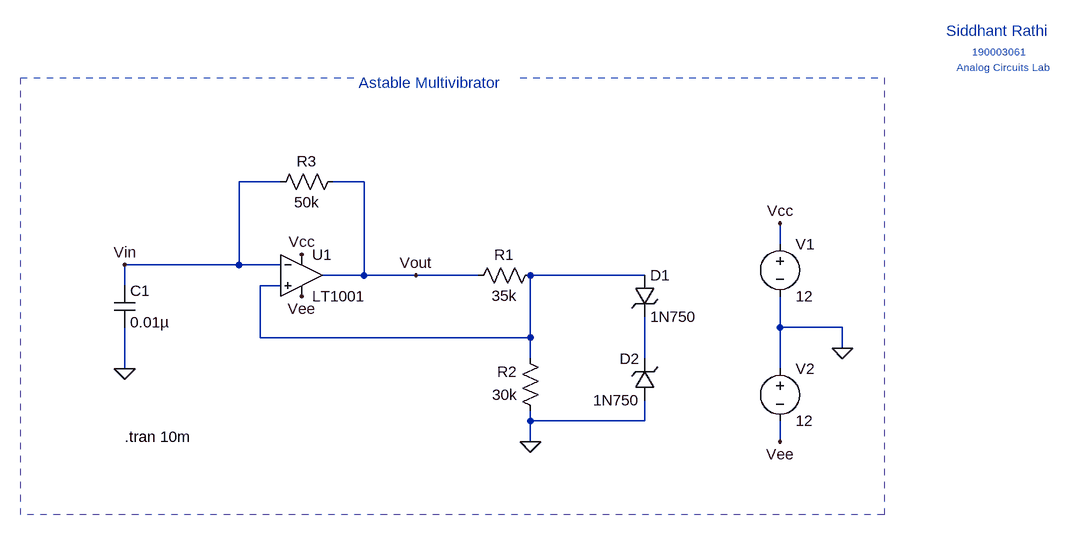
[diagram p0: schematic AstableMultivibrator.asc]
AstableMultivibrator.asc, the LTspice schematic file:
Version 4
SHEET 1 1780 680
WIRE 144 48 80 48
WIRE 272 48 224 48
WIRE 912 144 912 112
WIRE 80 176 80 48
WIRE 80 176 -96 176
WIRE 144 176 80 176
WIRE 272 192 272 48
WIRE 272 192 208 192
WIRE 352 192 272 192
WIRE 448 192 352 192
WIRE 704 192 528 192
WIRE -96 208 -96 176
WIRE 144 208 112 208
WIRE 912 272 912 224
WIRE 1008 272 912 272
WIRE 112 288 112 208
WIRE 528 288 528 192
WIRE 528 288 112 288
WIRE 1008 304 1008 272
WIRE 528 320 528 288
WIRE 704 320 704 256
WIRE -96 336 -96 272
WIRE 912 336 912 272
WIRE 528 416 528 400
WIRE 704 416 704 384
WIRE 704 416 528 416
WIRE 528 448 528 416
WIRE 912 448 912 416
FLAG -96 336 0
FLAG 528 448 0
FLAG 1008 304 0
FLAG 912 112 Vcc
FLAG 176 160 Vcc
FLAG 912 448 Vee
FLAG 176 224 Vee
FLAG -96 176 Vin
FLAG 352 192 Vout
SYMBOL OpAmps\\LT1001 176 128 R0
SYMATTR InstName U1
SYMBOL voltage 912 128 R0
WINDOW 123 0 0 Left 0
WINDOW 39 0 0 Left 0
SYMATTR InstName V1
SYMATTR Value 12
SYMBOL voltage 912 320 R0
WINDOW 123 0 0 Left 0
WINDOW 39 0 0 Left 0
SYMATTR InstName V2
SYMATTR Value 12
SYMBOL res 544 176 R90
WINDOW 0 0 56 VBottom 2
WINDOW 3 32 56 VTop 2
SYMATTR InstName R1
SYMATTR Value 35k
SYMBOL res 544 416 R180
WINDOW 0 36 76 Left 2
WINDOW 3 36 40 Left 2
SYMATTR InstName R2
SYMATTR Value 30k
SYMBOL cap -112 208 R0
SYMATTR InstName C1
SYMATTR Value 0.01µ
SYMBOL res 240 32 R90
WINDOW 0 0 56 VBottom 2
WINDOW 3 32 56 VTop 2
SYMATTR InstName R3
SYMATTR Value 50k
SYMBOL zener 688 192 R0
SYMATTR InstName D1
SYMATTR Value 1N750
SYMBOL zener 720 384 R180
WINDOW 0 24 64 Left 2
WINDOW 3 24 0 Left 2
SYMATTR InstName D2
SYMATTR Value 1N750
TEXT -96 440 Left 2 !.tran 10m
TEXT 264 -104 Left 2 ;Astable Multivibrator
TEXT 1168 -184 Left 2 ;Siddhant Rathi
TEXT 1208 -152 Left 1 ;190003061
TEXT 1184 -128 Left 1 ;Analog Circuits Lab
LINE Normal -256 -112 256 -112 2
LINE Normal -256 560 -256 -112 2
LINE Normal 1072 560 -256 560 2
LINE Normal 1072 -112 1072 560 2
LINE Normal 512 -112 1072 -112 2

The netlist it stands for:
* AstableMultivibrator.asc
XU1 N001 Vin Vcc Vee Vout LT1001  ; pins In+ In- V+ V- OUT
V1 Vcc 0 12
V2 0 Vee 12
R1 N001 Vout 35k
R2 0 N001 30k
C1 Vin 0 0.01µ
R3 Vout Vin 50k
D1 N001 N002 1N750
D2 0 N002 1N750
.model D D
.lib standard.dio
.tran 10m
* Astable Multivibrator
* Siddhant Rathi
* 190003061
* Analog Circuits Lab
.lib LTC.lib
.backanno
.end